# Altium schematic sheet slit_lamp_goggles_PCB_compressed.SchDoc
size 259 x 198 mm
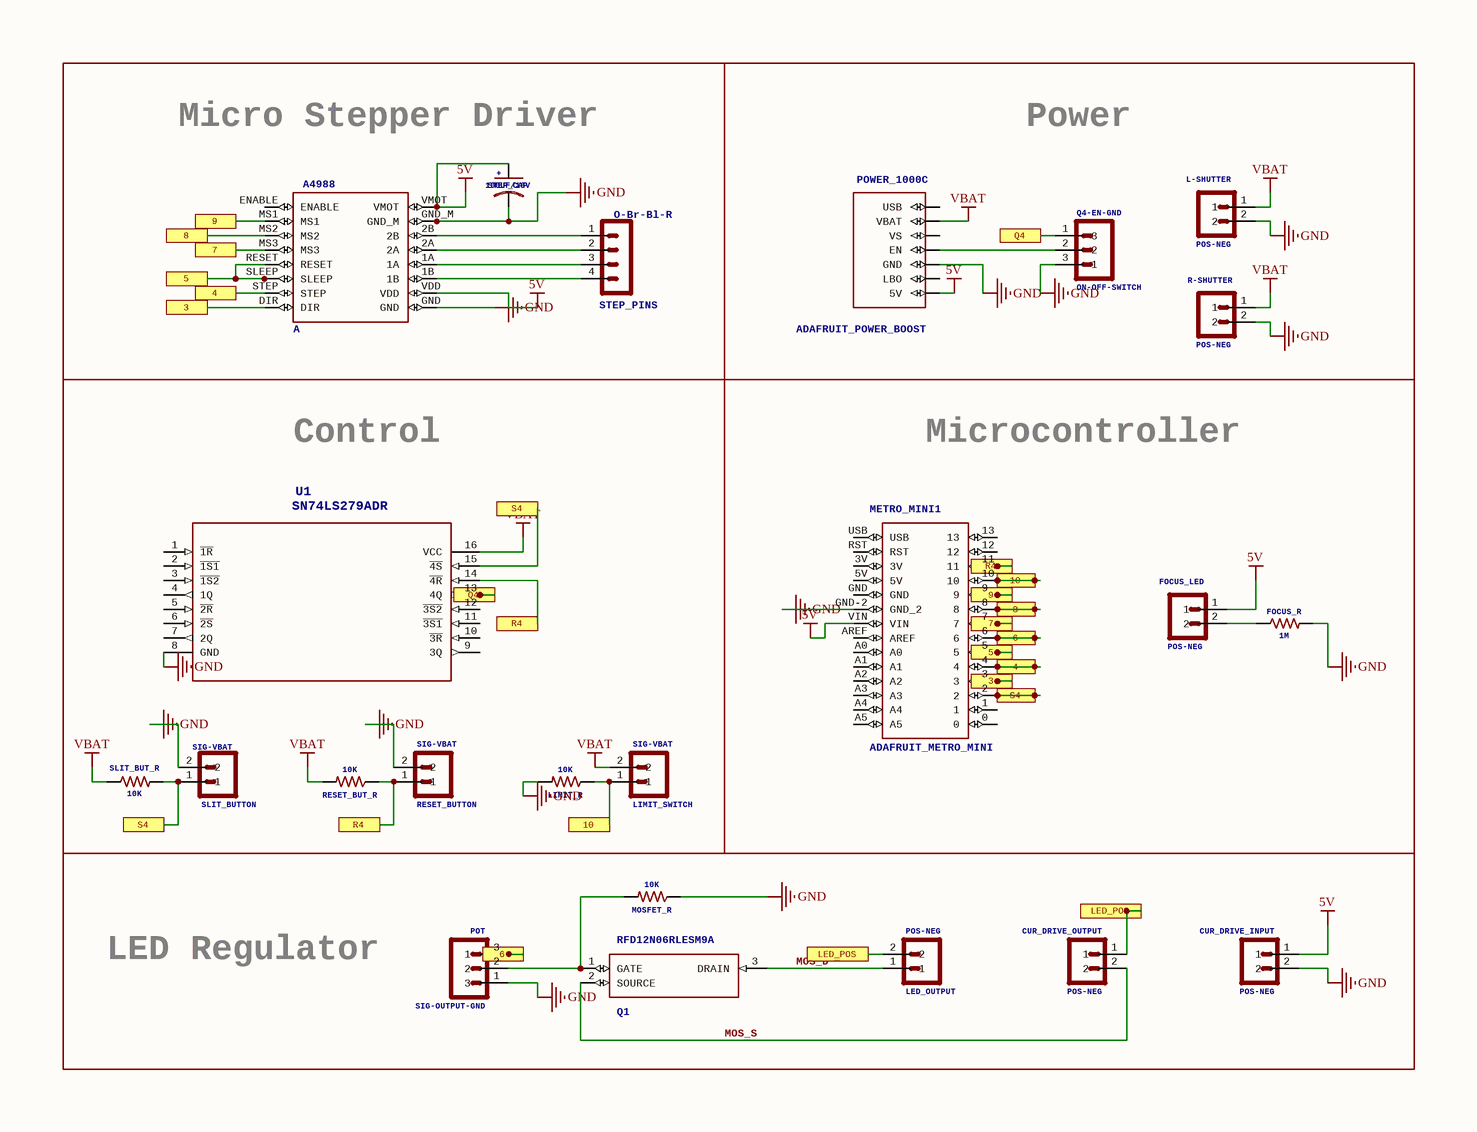
[diagram p0: slit_lamp_goggles_PCB_compressed.SchDoc]

## Parts
A4988  A  [A4988]
CUR_DRIVE_INPUT  POS-NEG  [HDRVR2W64P254_1X2_558X254X850B]
CUR_DRIVE_OUTPUT  POS-NEG  [HDRVR2W64P254_1X2_558X254X850B]
FOCUS_LED  POS-NEG  [HDRVR2W64P254_1X2_558X254X850B]
FOCUS_R  1M  [RESISTOR-PTH-0207/7]
L-SHUTTER  POS-NEG  [HDRVR2W64P254_1X2_558X254X850B]
LED_OUTPUT  POS-NEG  [HDRVR2W64P254_1X2_558X254X850B]
LIMIT_R  10K  [RESC1608X65_SMD-0603]
LIMIT_SWITCH  SIG-VBAT  [HDRVR2W64P254_1X2_558X254X850B]
METRO_MINI1  ADAFRUIT_METRO_MINI  [ADAFRUIT_METRO_MINI_2]
MOSFET_R  10K  [RESC1608X65_SMD-0603]
ON-OFF-SWITCH  Q4-EN-GND  [HDRVR3W64P254_1X3_812X254X850B]
POT  SIG-OUTPUT-GND  [HDRVR3W64P254_1X3_812X254X850B]
POWER_1000C  ADAFRUIT_POWER_BOOST  [ADAFRUIT_POWER_BOOST_1000C]
Q1  RFD12N06RLESM9A  [DPAK3-CASE-369AS]
R-SHUTTER  POS-NEG  [HDRVR2W64P254_1X2_558X254X850B]
RESET_BUT_R  10K  [RESC1608X65_SMD-0603]
RESET_BUTTON  SIG-VBAT  [HDRVR2W64P254_1X2_558X254X850B]
SLIT_BUT_R  10K  [RESC1608X65_SMD-0603]
SLIT_BUTTON  SIG-VBAT  [HDRVR2W64P254_1X2_558X254X850B]
STEP_CAP  100UF/16V  [_AE_SMD_L6.6-W6.6]
STEP_PINS  O-Br-Bl-R  [BM04B-SRSS-TB]
U1  SN74LS279ADR  [D16]

## Ports
3, 4, 5, 6, 7, 8, 9, 10, LED_POS, Q4, R4, S4

## Nets
5V: A4988.VDD A4988.VMOT CUR_DRIVE_INPUT.1 FOCUS_LED.1 METRO_MINI1.VIN POWER_1000C.5V STEP_CAP.A
GND: A4988.GND A4988.GND_M CUR_DRIVE_INPUT.2 FOCUS_R.2 L-SHUTTER.2 LIMIT_R.2 METRO_MINI1.GND-2(GND_2) MOSFET_R.1 ON-OFF-SWITCH.3(1) POT.1(3) POWER_1000C.GND@0_GND@1(GND) R-SHUTTER.2 RESET_BUTTON.2 SLIT_BUTTON.2 STEP_CAP.K U1.8(GND)
VBAT: L-SHUTTER.1 LIMIT_SWITCH.2 POWER_1000C.BAT(VBAT) R-SHUTTER.1 RESET_BUT_R.2 SLIT_BUT_R.1 U1.16(VCC)
3: A4988.DIR METRO_MINI1.3 ; port 3
4: A4988.STEP METRO_MINI1.4 ; port 4
5: A4988.RESET A4988.SLEEP METRO_MINI1.5 ; port 5
6: METRO_MINI1.6 POT.3(1) ; port 6
7: A4988.MS3 METRO_MINI1.7 ; port 7
8: A4988.MS2 METRO_MINI1.8 ; port 8
9: A4988.MS1 METRO_MINI1.9 ; port 9
10: LIMIT_R.1 LIMIT_SWITCH.1 METRO_MINI1.10 ; port 10
LED_POS: CUR_DRIVE_OUTPUT.1 LED_OUTPUT.2 ; port LED_POS
MOS_D: LED_OUTPUT.1 Q1.3(DRAIN)
MOS_S: CUR_DRIVE_OUTPUT.2 Q1.2(SOURCE)
Q4: ON-OFF-SWITCH.1(3) U1.13(4Q) ; port Q4
R4: METRO_MINI1.11 RESET_BUT_R.1 RESET_BUTTON.1 U1.14(~{4R}) ; port R4
S4: METRO_MINI1.2 SLIT_BUT_R.2 SLIT_BUTTON.1 U1.15(~{4S}) ; port S4
NetA4988_1A: A4988.1A STEP_PINS.3
NetA4988_1B: A4988.1B STEP_PINS.4
NetA4988_2A: A4988.2A STEP_PINS.2
NetA4988_2B: A4988.2B STEP_PINS.1
NetFOCUS_LED_2: FOCUS_LED.2 FOCUS_R.1
NetMOSFET_R_2: MOSFET_R.2 POT.2 Q1.1(GATE)
NetON-OFF-SWITCH_2: ON-OFF-SWITCH.2 POWER_1000C.EN

Not connected (* = marked no-connect by the designer): A4988 ENABLE; METRO_MINI1 0 1 3V 5V 12 13 A0 A1 A2 A3 A4 A5 AREF GND RST USB; POWER_1000C LB0(LBO) USB VS; U1 1(~{1R}) 2(~{1S1}) 3(~{1S2}) 4(1Q) 5(~{2R}) 6(~{2S}) 7(2Q) 9(3Q) 10(~{3R}) 11(~{3S1}) 12(~{3S2})

## Notes on the sheet
- (near STEP_CAP) Micro Stepper Driver
- Power
- Control
- Microcontroller
- LED Regulator

## Library data of the parts
A4988 = A4988: Motor Drive for Stepper Motor; GateName_1: G$1; SymbolName_1: A4988; LibraryName: a4988_stepDriver; DeviceSetName: A4988
CUR_DRIVE_INPUT CUR_DRIVE_OUTPUT FOCUS_LED L-SHUTTER LED_OUTPUT LIMIT_SWITCH R-SHUTTER RESET_BUTTON SLIT_BUTTON = 1X02_PTH_VERT_FEMALE_2.54MM: 2 Positions Header Connector 0.079" (2.00mm) Through Hole Tin; MFR: Sullins Connector Solutions; MPN: PPTC021LFBN-RC; GateName_1: G$1; SymbolName_1: 1X02; DIST: Digikey; DISTPN: S7000-ND; DeviceName: _PTH_VERT_FEMALE_2.54MM; LibraryName: PiB_connectors; DeviceSetName: 1X02; DATASHEET: https://drawings-pdf.s3.amazonaws.com/10492.pdf; DISTLINK: https://www.digikey.com/products/en?keywords=PPTC021LFBN-RC
FOCUS_R = RESISTOR_PTH-0207/7_1/8W-5%: GateName_1: G$1; TESTED: YES; SymbolName_1: RESISTOR; DeviceName: _PTH-0207/7_1/8W-5%; LibraryName: PiB_resistors; DeviceSetName: RESISTOR; CREATOR: MrSwirlyEyes
LIMIT_R MOSFET_R RESET_BUT_R SLIT_BUT_R = 10KΩ_SMD-0603_1/10W-5%: MFR: Yageo; MPN: RC0603JR-0710KL; GateName_1: G$1; SymbolName_1: RESISTOR; DeviceSetName: 10KΩ; DIST: Digikey; DISTPN: 311-10KGRCT-ND; DeviceName: _SMD-0603_1/10W-5%; LibraryName: PiB_resistors; DATASHEET: http://www.yageo.com/documents/recent/PYu-RC_Group_51_RoHS_L_9.pdf; DISTLINK: https://www.digikey.com/products/en?keywords=311-10KGRCT-ND
METRO_MINI1 = ADAFRUIT_METRO_MINI: GateName_1: G$1; SymbolName_1: ADAFRUIT_METRO_MINI; LibraryName: adafruit_metro_mini; DeviceSetName: ADAFRUIT_METRO_MINI
ON-OFF-SWITCH POT = 1X03_PTH_VERT_FEMALE_2.54MM: MFR: Sullins Connector Solutions; MPN: PPTC031LFBN-RC; GateName_1: G$1; SymbolName_1: 1X03; DIST: Digikey; DISTPN: S7001-ND; DeviceName: _PTH_VERT_FEMALE_2.54MM; LibraryName: PiB_connectors; DeviceSetName: 1X03; DATASHEET: https://drawings-pdf.s3.amazonaws.com/10492.pdf; DISTLINK: https://www.digikey.com/products/en?keywords=PPTC031LFBN-RC
POWER_1000C = ADAFRUIT_POWER_BOOST: GateName_1: G$1; SymbolName_1: ADAFRUIT_POWER_BOOST; LibraryName: adafruit_power_1000c; DeviceSetName: ADAFRUIT_POWER_BOOST
Q1 = RFD12N06RLESM9A: MOSFET   Source:  Datasheet; MANUFACTURER_NAME: ON Semiconductor; GateName_1: G$1; SymbolName_1: RFD12N06RLESM9A; LibraryName: mosfet_smd; DeviceSetName: RFD12N06RLESM9A; HEIGHT: mm; MANUFACTURER_PART_NUMBER: RFD12N06RLESM9A; MOUSER_PART_NUMBER: 512-RFD12N06RLESM9A; MOUSER_PRICE-STOCK: https://www.mouser.com/Search/Refine.aspx?Keyword=512-RFD12N06RLESM9A; RS_PART_NUMBER: 8022143P; RS_PRICE-STOCK: http://uk.rs-online.com/web/p/products/8022143P
STEP_CAP = 100UF-POLARIZED_SMD_16V-20%_L6.6-W6.6: MFR: Panasonic Electronic Components; MPN: EEE-FK1C101P; GateName_1: G$1; SymbolName_1: CAPACITOR_POLARIZED; DIST: Digikey; DISTPN: PCE3783CT-ND; TESTED: NO; DeviceName: _SMD_16V-20%_L6.6-W6.6; LibraryName: PiB_capacitors; DeviceSetName: 100UF-POLARIZED; +: +; CREATOR: MrSwirlyEyes; DATASHEET: http://industrial.panasonic.com/www-cgi/jvcr13pz.cgi?E+PZ+3+ABA0120+EEEFK1C101P+7+WW; DISTLINK: https://www.digikey.com/products/en?keywords=PCE3783CT-ND
STEP_PINS = BM04B-SRSS-TB: JST SH series header 1.00mm pitch disconnectable crimp style connectors, vertical (side entry type), 4 pins; GateName_1: G$1; SymbolName_1: M_1R04; DeviceName: -TB; LibraryName: con-JST SH; DeviceSetName: BM04B-SRSS
U1 = SN74LS279ADR: MANUFACTURER: Texas Instruments; GateName_1: A; SymbolName_1: SN74LS279A_D_16; BUILT_BY: EMA_UL_Team; LibraryName: SRlatch; DeviceSetName: SN74LS279ADR; MANUFACTURER_PART_NUMBER: SN74LS279ADR; VENDOR: Vendor